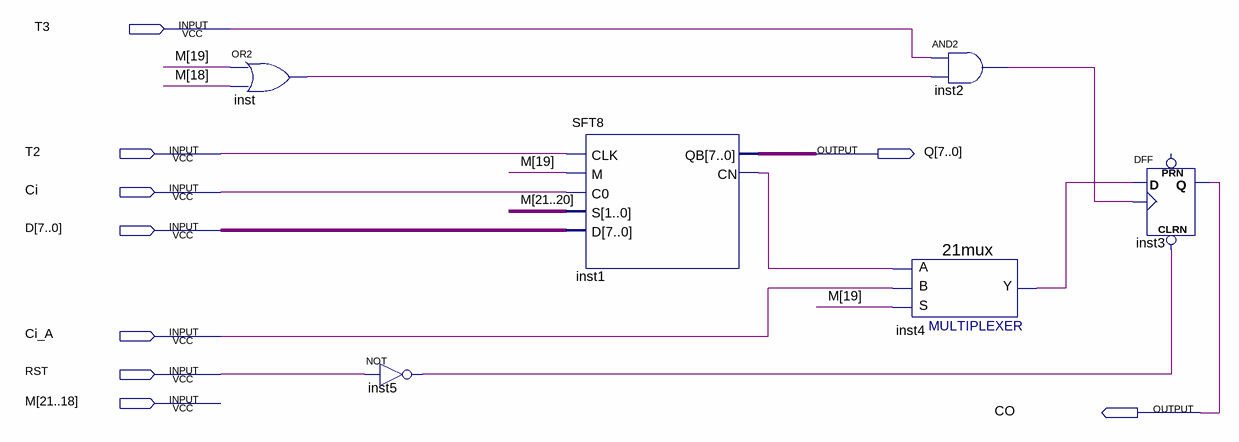
[diagram p0: schematic sheet]
// Quartus schematic SHIFT_1.bdf as structural Verilog: 6 symbols, 9 pins
module SHIFT_1 (
  input  T3,
  input  T2,
  input  Ci,
  input  [7:0] D,
  input  Ci_A,
  input  RST,
  input  [21:18] M,
  output [7:0] Q,
  output CO
);

  wire inst1_cn, inst2_out, inst4_y, inst5_out, inst_out;

  or inst (inst_out, M[19], M[18]);
  not inst5 (inst5_out, RST);
  SFT8 inst1 (.CLK(T2), .M(M[19]), .C0(Ci), .S(M[21:20]), .D(D), .QB(Q), .CN(inst1_cn));
  \21mux  inst4 (.S(M[19]), .B(Ci_A), .A(inst1_cn), .Y(inst4_y));
  and inst2 (inst2_out, T3, inst_out);
  DFF inst3 (.CLRN(inst5_out), .CLK(inst2_out), .D(inst4_y), .Q(CO));  // open: PRN
endmodule
